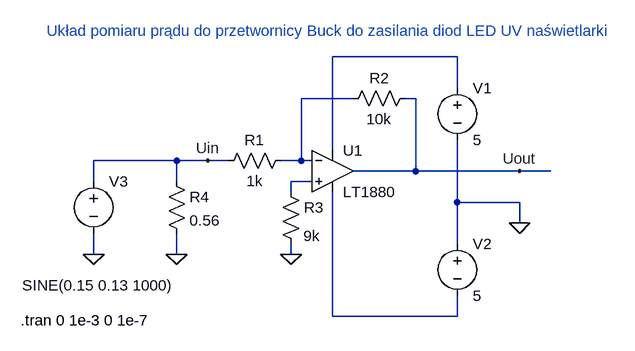
[diagram p0: schematic Buck_current_measurement.asc]
Buck_current_measurement.asc, the LTspice schematic file:
Version 4
SHEET 1 880 680
WIRE 336 -32 144 -32
WIRE 336 16 336 -32
WIRE 176 32 96 32
WIRE 272 32 256 32
WIRE 144 112 144 -32
WIRE -96 128 -224 128
WIRE -48 128 -96 128
WIRE -16 128 -48 128
WIRE 96 128 96 32
WIRE 96 128 64 128
WIRE 112 128 96 128
WIRE 272 144 272 32
WIRE 272 144 176 144
WIRE 432 144 272 144
WIRE 480 144 432 144
WIRE -224 160 -224 128
WIRE -96 160 -96 128
WIRE 112 160 80 160
WIRE 80 176 80 160
WIRE 336 192 336 96
WIRE 432 192 336 192
WIRE 432 224 432 192
WIRE 336 256 336 192
WIRE -224 272 -224 240
WIRE -96 272 -96 240
WIRE 80 272 80 256
WIRE 144 368 144 176
WIRE 336 368 336 336
WIRE 336 368 144 368
FLAG 432 224 0
FLAG 432 144 Uout
FLAG -48 128 Uin
FLAG -96 272 0
FLAG -224 272 0
FLAG 80 272 0
SYMBOL Opamps\\LT1880 144 144 R0
SYMATTR InstName U1
SYMBOL voltage 336 0 R0
WINDOW 123 0 0 Left 0
WINDOW 39 0 0 Left 0
SYMATTR InstName V1
SYMATTR Value 5
SYMBOL voltage 336 240 R0
WINDOW 123 0 0 Left 0
WINDOW 39 0 0 Left 0
SYMATTR InstName V2
SYMATTR Value 5
SYMBOL res 80 112 R90
WINDOW 0 0 56 VBottom 2
WINDOW 3 32 56 VTop 2
SYMATTR InstName R1
SYMATTR Value 1k
SYMBOL res 272 16 R90
WINDOW 0 0 56 VBottom 2
WINDOW 3 32 56 VTop 2
SYMATTR InstName R2
SYMATTR Value 10k
SYMBOL res 64 160 R0
WINDOW 3 35 84 Left 2
SYMATTR InstName R3
SYMATTR Value 9k
SYMATTR SpiceLine tol=1 pwr=0.25
SYMBOL voltage -224 144 R0
WINDOW 3 -110 176 Left 2
WINDOW 123 0 0 Left 0
WINDOW 39 0 0 Left 0
SYMATTR InstName V3
SYMATTR Value SINE(0.15 0.13 1000)
SYMBOL res -112 144 R0
SYMATTR InstName R4
SYMATTR Value 0.56
SYMATTR SpiceLine tol=1 pwr=0.25
TEXT -296 -72 Left 2 ;Układ pomiaru prądu do przetwornicy Buck do zasilania diod LED UV naświetlarki
TEXT -336 374 Left 2 !.tran 0 1e-3 0 1e-7

The netlist it stands for:
* Buck_current_measurement.asc
* U1: LT1880 (symbol Opamps\LT1880 not available, pins judged from their places): In+=N003 In-=N002 V+=N001 V-=N004 OUT=Uout
V1 N001 0 5
V2 0 N004 5
R1 N002 Uin 1k
R2 Uout N002 10k
R3 N003 0 9k tol=1 pwr=0.25
V3 Uin 0 SINE(0.15 0.13 1000)
R4 Uin 0 0.56 tol=1 pwr=0.25
* Układ pomiaru prądu do przetwornicy Buck do zasilania diod LED UV naświetlarki
.tran 0 1e-3 0 1e-7
.backanno
.end